# EAGLE design Siguino (EAGLE 9.2.2)
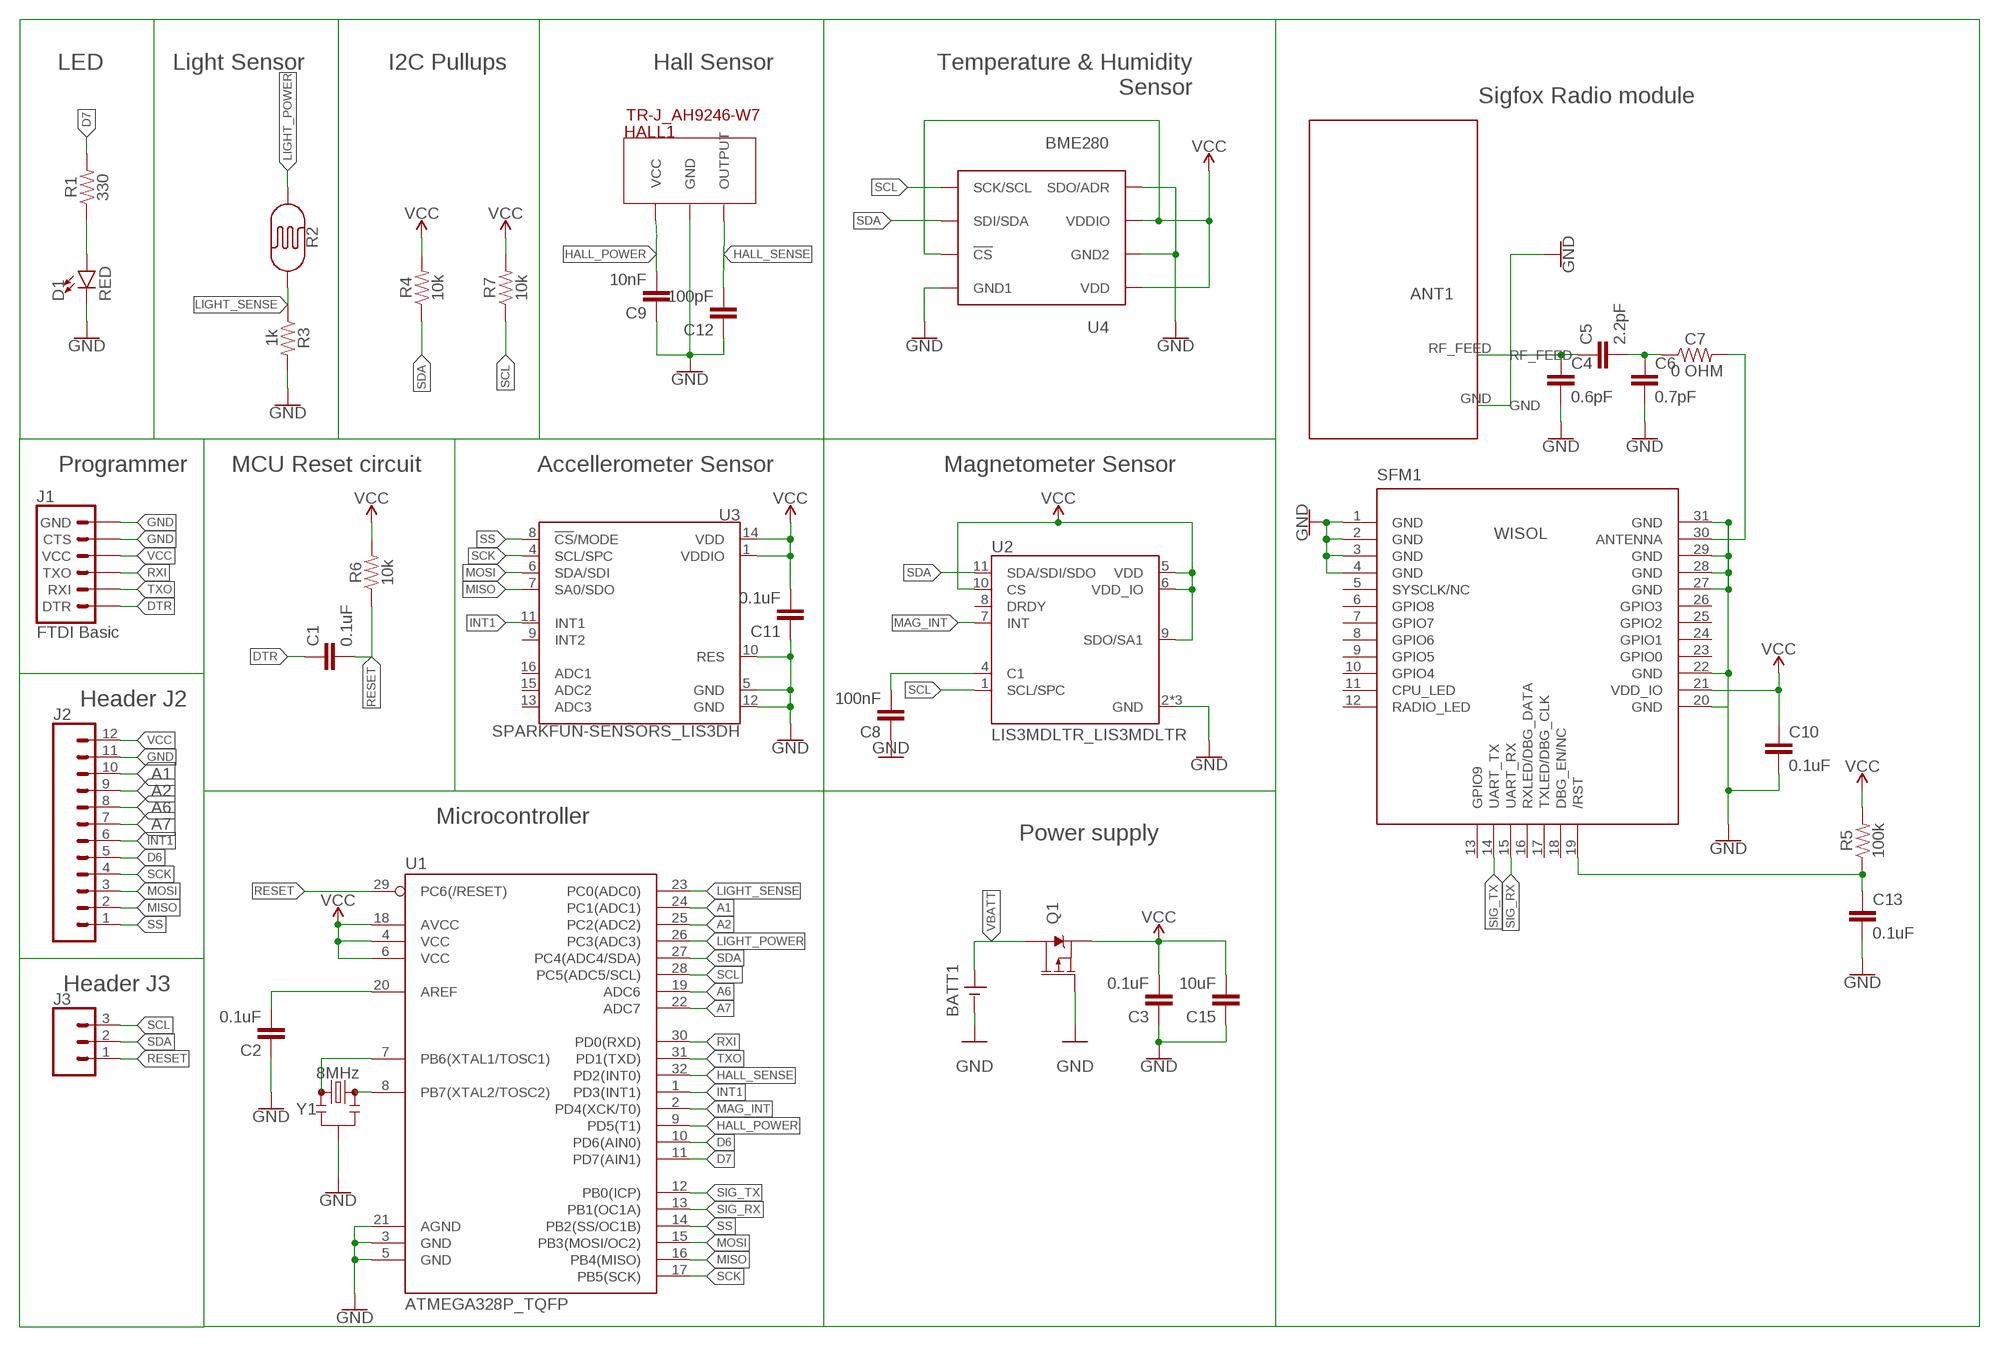
[diagram p0: schematic, sheet 1]

## Parts
ANT1  PROOB471  PRO-OB-512ONBOARD  [ONBOARD_SMD_2400]
BATT1  SPARKFUN-BATTERIES_CR2-BATTERY-HOLDERPTH  [SPARKFUN-BATTERIES_BATTERYHOLDER-CR2]
C1  0.1uF  0.1UF-0603-25V-5%  [0603]
C2  0.1uF  0.1UF-0603-25V-5%  [0603]
C3  0.1uF  0.1UF-0603-25V-5%  [0603]
C4  0.6pF  0.8PF-0402-50V-0.1PF  [0402]
C5  2.2pF  0.8PF-0402-50V-0.1PF  [0402]
C6  0.7pF  0.8PF-0402-50V-0.1PF  [0402]
C7  0 OHM  RESISTOR0402  [0402]
C8  100nF  0.1UF-0603-25V-5%  [0603]
C9  10nF  10NF-0603-50V-10%  [0603]
C10  0.1uF  0.1UF-0603-25V-(+80/-20%)  [0603]
C11  0.1uF  0.1UF-0603-25V-5%  [0603]
C12  100pF  100PF-0603-50V-5%  [0603]
C13  0.1uF  0.1UF-0603-25V-(+80/-20%)  [0603]
C15  10uF  10UF-0603-6.3V-20%  [0603]
D1  RED  LED-RED0603  [LED-0603]
HALL1  TR-J_AH9246-W7  [TR-J_SC-59]
J1  FTDI Basic  6_PIN_SERIAL_TARGET  [1X06]
J2  CONN_12  [1X12]
J3  CONN_03  [1X03]
Q1  MOSFET P-CH 20V 5.3A SOT-23  MOSFET_PCHSI2323DDS  [SOT23-3]
R1  330  330OHM-0603-1/10W-1%  [0603]
R2  PHOTOCELLPTH  [PHOTOCELL]
R3  1k  1KOHM-0603-1/10W-1%  [0603]
R4  10k  10KOHM-0603-1/10W-1%  [0603]
R5  100k  100KOHM-0603-1/10W-1%  [0603]
R6  10k  10KOHM-0603-1/10W-1%  [0603]
R7  10k  10KOHM-0603-1/10W-1%  [0603]
SFM1  WISOL_WSSFM10HANDSOLDER  [WISOL_WSSFM10]
U1  ATMEGA328P_TQFP  [TQFP32-08]
U2  LIS3MDLTR_LIS3MDLTR  [LIS3MDLTR_LGA12R50P4X4_200X200X100]
U3  SPARKFUN-SENSORS_LIS3DH  [SPARKFUN-SENSORS_LGA-16-3X3]
U4  BME280  BME280COMPONENTLIBRARY_BME280  [BME280COMPONENTLIBRARY_BME280_LGA]
Y1  8MHz  RESONATOR-8MHZSMD_3.2X1.3  [RESONATOR-SMD-3.2X1.3]

## Nets
A1: J2.10 U1.24(PC1(ADC1))
A2: J2.9 U1.25(PC2(ADC2))
A6: J2.8 U1.19(ADC6)
A7: J2.7 U1.22(ADC7)
D6: J2.5 U1.10(PD6(AIN0))
D7: R1.2 U1.11(PD7(AIN1))
DTR: C1.1 J1.1(DTR)
GND: ANT1.GND BATT1.GND C2.1 C3.1 C4.2 C6.2 C8.1 C9.1 C10.2 C11.1 C12.1 C13.2 C15.1 D1.C HALL1.3(GND) J1.5(CTS) J1.6(GND) J2.11 Q1.1(G) R3.2 SFM1.1(GND) SFM1.2(GND) SFM1.3(GND) SFM1.4(GND) SFM1.20(GND) SFM1.22(GND) SFM1.27(GND) SFM1.28(GND) SFM1.29(GND) SFM1.31(GND) U1.3(GND) U1.5(GND) U1.21(AGND) U2.2(GND) U2.3(GND) U2.12(GND) U3.5(GND) U3.10(RES) U3.12(GND) U4.P$1(GND1) U4.P$5(SDO/ADR) U4.P$7(GND2) Y1.2
HALL_POWER: C9.2 HALL1.1(VCC) U1.9(PD5(T1))
HALL_SENSE: C12.2 HALL1.2(OUTPUT) U1.32(PD2(INT0))
INT1: J2.6 U1.1(PD3(INT1)) U3.11(INT1)
LIGHT_POWER: R2.1 U1.26(PC3(ADC3))
LIGHT_SENSE: R2.2 R3.1 U1.23(PC0(ADC0))
MAG_INT: U1.2(PD4(XCK/T0)) U2.7(INT)
MISO: J2.2 U1.16(PB4(MISO)) U3.7(SA0/SDO)
MOSI: J2.3 U1.15(PB3(MOSI/OC2)) U3.6(SDA/SDI)
N$1: C2.2 U1.20(AREF)
N$2: U1.8(PB7(XTAL2/TOSC2)) Y1.3
N$3: U1.7(PB6(XTAL1/TOSC1)) Y1.1
N$4: ANT1.RF_FEED C4.1 C5.1
N$5: C13.1 R5.1 SFM1.19(/RST)
N$6: C7.2 SFM1.30(ANTENNA)
N$7: C5.2 C6.1 C7.1
N$9: C8.2 U2.4(C1)
N$19: D1.A R1.1
RESET: C1.2 J3.1 R6.1 U1.29(PC6(/RESET))
RXI: J1.3(TXO) U1.30(PD0(RXD))
SCK: J2.4 U1.17(PB5(SCK)) U3.4(SCL/SPC)
SCL: J3.3 R7.1 U1.28(PC5(ADC5/SCL)) U2.1(SCL/SPC) U4.P$4(SCK/SCL)
SDA: J3.2 R4.1 U1.27(PC4(ADC4/SDA)) U2.11(SDA/SDI/SDO) U4.P$3(SDI/SDA)
SIG_RX: SFM1.15(UART_RX) U1.13(PB1(OC1A))
SIG_TX: SFM1.14(UART_TX) U1.12(PB0(ICP))
SS: J2.1 U1.14(PB2(SS/OC1B)) U3.8(!CS!/MODE)
TXO: J1.2(RXI) U1.31(PD1(TXD))
VBATT: BATT1.VBATT Q1.3(D)
VCC: C3.2 C10.1 C11.2 C15.2 J1.4(VCC) J2.12 Q1.2(S) R4.2 R5.2 R6.2 R7.2 SFM1.21(VDD_IO) U1.4(VCC) U1.6(VCC) U1.18(AVCC) U2.5(VDD) U2.6(VDD_IO) U2.9(SDO/SA1) U2.10(CS) U3.1(VDDIO) U3.14(VDD) U4.P$2(!CS) U4.P$6(VDDIO) U4.P$8(VDD)
Unconnected: SFM1.5(SYSCLK/NC) SFM1.6(GPIO8) SFM1.7(GPIO7) SFM1.8(GPIO6) SFM1.9(GPIO5) SFM1.10(GPIO4) SFM1.11(CPU_LED) SFM1.12(RADIO_LED) SFM1.13(GPIO9) SFM1.16(RXLED/DBG_DATA) SFM1.17(TXLED/DBG_CLK) SFM1.18(DBG_EN/NC) SFM1.23(GPIO0) SFM1.24(GPIO1) SFM1.25(GPIO2) SFM1.26(GPIO3) U2.8(DRDY) U3.9(INT2) U3.13(ADC3) U3.15(ADC2) U3.16(ADC1)

## Notes on the sheet
- LED | Light Sensor | Hall Sensor
- Temperature & Humidity
  Sensor
- I2C Pullups
- Sigfox Radio module
- Programmer | MCU Reset circuit | Accellerometer Sensor | Magnetometer Sensor
- Header J2
- Microcontroller
- Power supply
- Header J3

## Library data of the parts
ANT1 = proant:PRO-OB-512: Proant OnBoard Antenna PRO-OB-512 for 848/2400MHz comms (e.g. SigFox)
BATT1 = Siguino:SPARKFUN-BATTERIES_CR2-BATTERY-HOLDER: CR2 Battery holder from MPD, see DigiKey product here: https://www.digikey.ie/product-detail/en/mpd-memory-protection-devices/BH-CR2-PC/BH-CR2-PC-ND/3029219
C1-C3 C11 = SparkFun-Capacitors:0.1UF: 0.1µF ceramic capacitors A capacitor is a passive two-terminal electrical component used to store electrical energy temporarily in an electric field.; PROD_ID: CAP-08604
C4-C6 = SparkFun-Capacitors:0.8PF: 0.8pF ceramic capacitors A capacitor is a passive two-terminal electrical component used to store electrical energy temporarily in an electric field.; PROD_ID: CAP-13456; VALUE: 0.8pF
C7 = SparkFun-Resistors:RESISTOR: Generic Resistor Package
C8 = SparkFun-Capacitors:0.1UF: 0.1µF ceramic capacitors A capacitor is a passive two-terminal electrical component used to store electrical energy temporarily in an electric field.; PROD_ID: CAP-08604; VALUE: 0.1uF
C9 = SparkFun-Capacitors:10NF: 0.01uF/10nF/10,000pF ceramic capacitors A capacitor is a passive two-terminal electrical component used to store electrical energy temporarily in an electric field. CAP-09321; PROD_ID: CAP-00867
C10 C13 = SparkFun-Capacitors:0.1UF: 0.1µF ceramic capacitors A capacitor is a passive two-terminal electrical component used to store electrical energy temporarily in an electric field.; PROD_ID: CAP-00810
C12 = SparkFun-Capacitors:100PF: 100pF/0.1nF ceramic capacitors A capacitor is a passive two-terminal electrical component used to store electrical energy temporarily in an electric field.; PROD_ID: CAP-07883
C15 = SparkFun-Capacitors:10UF: 10.0µF ceramic capacitors A capacitor is a passive two-terminal electrical component used to store electrical energy temporarily in an electric field.; PROD_ID: CAP-11015
D1 = SparkFun-LED:LED-RED: Red SMD LED Used in manufacturing of most products at SparkFun Packages: 0603 - SMD 0603 package [Product Link] <http://docs.avagotech.com/docs/AV02-0551EN> 0603 SMART - SMD 0603 SMART package ( more efficient and expensive)[Product Link] <http://www.osram-os.com/Graphics/XPic2/00077099_0.pdf> 1206 - SMD1206 package [Product Link] <https://www.sparkfun.com/datasheets/DevTools/LilyPad/Q150OVS4.pdff> SparkFun Products: Pro Mini 328 -5V <https://www.sparkfun.com/products/821> RedBoard <https://www.sparkfun.com/products/12757> IOIO-OTG <https://www.sparkfun.com/products/13613>; PROD_ID: DIO-00819
HALL1 = Siguino:TR-J_AH9246-W7: Hall effect switch, surface mount, part number AH9246-W-7
J1 = SparkFun-Connectors:6_PIN_SERIAL_TARGET: 6-pin header connection for use with the "FTDI BASIC" pinout - TARGET SIDE. Also known as "Arduino Serial Program Header". It is used to mate with our FTDI Basic serial programmers using the Arduino IDE. Note, this device has "TARGET" in the name. It is intended to be used on a design that contains a target micro-controller that you wish to program. The "sister" device, named "CABLE" is inteneded to be used on a design that usually lives on the end of your USB cable and prvides the converter chip (FTDI232 or FTDI231x) to commnicate serial RX/TX. You can populate with some of these: Break Away Headers - Straight <https://www.sparkfun.com/products/116> (PRT-00116) For reference (or to suit your programming needs) check out these designs: SparkFun FTDI Basic Breakout - 5V <https://www.sparkfun.com/products/9716> (DEV-09716) SparkFun FTDI Basic Breakout - 3.3V <https://www.sparkfun.com/products/9873> (DEV-09873) SparkFun FTDI SmartBasic <https://www.sparkfun.com/products/12935> (DEV-12935) SparkFun Beefy 3 - FTDI Basic Breakout <https://www.sparkfun.com/products/13746> (DEV-13746)
J2 = SparkFun-Connectors:CONN_12: Multi connection point. Often used as Generic Header-pin footprint for 0.1 inch spaced/style header connections On any of the 0.1 inch spaced packages, you can populate with these: Break Away Headers - Straight <https://www.sparkfun.com/products/116> (PRT-00116) Break Away Male Headers - Right Angle <https://www.sparkfun.com/products/553> (PRT-00553) Female Headers <https://www.sparkfun.com/products/115> (PRT-00115) Break Away Headers - Machine Pin <https://www.sparkfun.com/products/117> (PRT-00117) Break Away Female Headers - Swiss Machine Pin <https://www.sparkfun.com/products/743> (PRT-00743) For SCREWTERMINALS and SPRING TERMINALS visit here: Screw Terimnals on SparkFun.com <https://www.sparkfun.com/search/results?term=Screw+Terminals> (5mm/3.5mm/2.54mm spacing) This device is also useful as a general connection point to wire up your design to another part of your project. Our various solder wires solder well into these plated through hole pads. Hook-Up Wire - Assortment (Stranded, 22 AWG) <https://www.sparkfun.com/products/11375> (PRT-11375) Hook-Up Wire - Assortment (Solid Core, 22 AWG) <https://www.sparkfun.com/products/11367> (PRT-11367) View the entire wire category on our website here <https://www.sparkfun.com/categories/141> Special notes: Molex polarized connector foot print use with SKU : PRT-08231 with associated crimp pins and housings. 1MM SMD Version SKU: PRT-10208 NOTES ON THE VARIANTS LOCK and LOCK_LONGPADS... This footprint was designed to help hold the alignment of a through-hole component (i.e. 6-pin header) while soldering it into place. You may notice that each hole has been shifted either up or down by 0.005 of an inch from it's more standard position (which is a perfectly straight line). This slight alteration caused the pins (the squares in the middle) to touch the edges of the holes. Because they are alternating, it causes a "brace" to hold the component in place. 0.005 has proven to be the perfect amount of "off-center" position when using our standard breakaway headers. Although looks a little odd when you look at the bare footprint, once you have a header in there, the alteration is very hard to notice. Also,if you push a header all the way into place, it is covered up entirely on the bottom side.
J3 = SparkFun-Connectors:CONN_03: Multi connection point. Often used as Generic Header-pin footprint for 0.1 inch spaced/style header connections On any of the 0.1 inch spaced packages, you can populate with these: Break Away Headers - Straight <https://www.sparkfun.com/products/116> (PRT-00116) Break Away Male Headers - Right Angle <https://www.sparkfun.com/products/553> (PRT-00553) Female Headers <https://www.sparkfun.com/products/115> (PRT-00115) Break Away Headers - Machine Pin <https://www.sparkfun.com/products/117> (PRT-00117) Break Away Female Headers - Swiss Machine Pin <https://www.sparkfun.com/products/743> (PRT-00743) Stackable Header - 3 Pin (Female, 0.1") <https://www.sparkfun.com/products/13875> (PRT-13875) For SCREWTERMINALS and SPRING TERMINALS visit here: Screw Terimnals on SparkFun.com <https://www.sparkfun.com/search/results?term=Screw+Terminals> (5mm/3.5mm/2.54mm spacing) This device is also useful as a general connection point to wire up your design to another part of your project. Our various solder wires solder well into these plated through hole pads. Hook-Up Wire - Assortment (Stranded, 22 AWG) <https://www.sparkfun.com/products/11375> (PRT-11375) Hook-Up Wire - Assortment (Solid Core, 22 AWG) <https://www.sparkfun.com/products/11367> (PRT-11367) View the entire wire category on our website here <https://www.sparkfun.com/categories/141> Special notes: Molex polarized connector foot print use with SKU : PRT-08232 with associated crimp pins and housings.
Q1 = SparkFun-DiscreteSemi:MOSFET_PCH: P-channel MOSFETs Voltage controlled devices that allow control of high current outputs E.g. See Digikey Product here: SI2323DDS-T1-GE3 <https://www.digikey.ie/product-detail/en/vishay-siliconix/SI2323DDS-T1-GE3/SI2323DDS-T1-GE3CT-ND/4142086>; PROD_ID: SI2323DDS-T1-GE3
R1 = SparkFun-Resistors:330OHM: 330Ω resistor A resistor is a passive two-terminal electrical component that implements electrical resistance as a circuit element. Resistors act to reduce current flow, and, at the same time, act to lower voltage levels within circuits. - Wikipedia; PROD_ID: RES-00818
R2 = SparkFun-Sensors:PHOTOCELL: Photocell (Photodetector, Photo Resistor, CdS) This is a very small light sensor. A photocell changes (also called a photodetector, photo resistor, CdS or photoconductive cell) resistance depending on the amount of light it is exposed to. These little sensors make great ambient light triggers (when light in the room turns on, do something). Datasheet <http://cdn.sparkfun.com/datasheets/Sensors/LightImaging/SEN-09088.pdf> SparkFun Products Mini Photocell <https://www.sparkfun.com/products/9088> (SEN-09088); PROD_ID: COMP-09129; SF_ID: SEN-09088
R3 = SparkFun-Resistors:1KOHM: 1kΩ resistor A resistor is a passive two-terminal electrical component that implements electrical resistance as a circuit element. Resistors act to reduce current flow, and, at the same time, act to lower voltage levels within circuits. - Wikipedia; PROD_ID: RES-07856
R4 R6 R7 = SparkFun-Resistors:10KOHM: 10kΩ resistor A resistor is a passive two-terminal electrical component that implements electrical resistance as a circuit element. Resistors act to reduce current flow, and, at the same time, act to lower voltage levels within circuits. - Wikipedia; PROD_ID: RES-00824
R5 = SparkFun-Resistors:100KOHM: 100kΩ resistor A resistor is a passive two-terminal electrical component that implements electrical resistance as a circuit element. Resistors act to reduce current flow, and, at the same time, act to lower voltage levels within circuits. - Wikipedia; PROD_ID: RES-07828
SFM1 = Siguino:WISOL_WSSFM10: WiSOL WSSFM10 Sigfox Module with PCB Footprint to enable handsolder
U1 = SparkFun-IC-Microcontroller:ATMEGA328P_TQFP: Popular 328P in QFP Storefront component: ATmega328 - TQFP <https://www.sparkfun.com/products/13448> (COM-13448) Datasheet <http://www.sparkfun.com/datasheets/Components/SMD/ATMega328.pdf> SparkFun Products SparkFun RedBoard - Programmed with Arduino <https://www.sparkfun.com/products/12757> (DEV-12757) Arduino Pro Mini 328 - 5V/16MHz <https://www.sparkfun.com/products/11113> (DEV-11113) Arduino Pro Mini 328 - 3.3V/8MHz <https://www.sparkfun.com/products/11114> (DEV-11114) SparkFun OpenLog <https://www.sparkfun.com/products/13712> (DEV-13712) SparkFun MicroView - OLED Arduino Module <https://www.sparkfun.com/products/12923> (DEV-12923) SparkFun Digital Sandbox <https://www.sparkfun.com/products/12651> (DEV-12651) SparkFun PicoBoard <https://www.sparkfun.com/products/11888> (WIG-11888) Arduino Fio <https://www.sparkfun.com/products/10116> (DEV-10116) LilyPad Arduino 328 Main Board <https://www.sparkfun.com/products/13342> (DEV-13342) SparkFun RedStick <https://www.sparkfun.com/products/13741> (DEV-13741) LilyPad MP3 <https://www.sparkfun.com/products/11013> (DEV-11013) LilyPad Arduino SimpleSnap <https://www.sparkfun.com/products/10941> (DEV-10941) SparkFun Stepoko <https://www.sparkfun.com/products/13899> (ROB-13899) SparkFun Geiger Counter <https://www.sparkfun.com/products/11345> (SEN-11345) SparkFun EL Sequencer <https://www.sparkfun.com/products/12781> (COM-12781) Arduino Pro 328 - 5V/16MHz <https://www.sparkfun.com/products/10915> (DEV-10915) CryptoCape <https://www.sparkfun.com/products/12773> (DEV-12773) SparkFun IR Thermometer Evaluation Board - MLX90614 <https://www.sparkfun.com/products/10740> (SEN-10740) SparkFun RedBot Mainboard <https://www.sparkfun.com/products/12097> (ROB-12097) Arduino Pro 328 - 3.3V/8MHz <https://www.sparkfun.com/products/10914> (DEV-10914) SparkFun Block for Intel® Edison - Arduino <https://www.sparkfun.com/products/13036> (DEV-13036) SparkFun Simon Says - Surface Mount Soldering Kit <https://www.sparkfun.com/products/10935> (KIT-10935) SparkFun 7-Segment Serial Display - Red <https://www.sparkfun.com/products/11441> (COM-11441) SparkFun 7-Segment Serial Display - White <https://www.sparkfun.com/products/11629> (COM-11629) SparkFun 7-Segment Serial Display - Yellow <https://www.sparkfun.com/products/11443> (COM-11443) SparkFun 7-Segment Serial Display - Kelly Green <https://www.sparkfun.com/products/11440> (COM-11440) SparkFun 7-Segment Serial Display - Blue <https://www.sparkfun.com/products/11442> (COM-11442) SparkFun OpenSegment Serial Display - 20mm (Blue) <https://www.sparkfun.com/products/11647> (COM-11647) SparkFun OpenSegment Serial Display - 20mm (Green) <https://www.sparkfun.com/products/11646> (COM-11646) SparkFun OpenSegment Serial Display - 20mm (White) <https://www.sparkfun.com/products/11648> (COM-11648) SparkFun OpenSegment Serial Display - 20mm (Red) <https://www.sparkfun.com/products/11644> (COM-11644) SparkFun OpenSegment Serial Display - 20mm (Yellow) <https://www.sparkfun.com/products/11645> (COM-11645) SparkFun OpenSegment Shield <https://www.sparkfun.com/products/13190> (DEV-13190); PROD_ID: IC-09069
U2 = Siguino:LIS3MDLTR_LIS3MDLTR: LIS3MDL Series 3 Axis ±2/±8/±12/±16 g 3.6V High Performance Magnetometer LGA-12; DESCRIPTION: SENSOR MAGMTR I2C/SPI 12LGA; DIGI-KEY_PART_NUMBER: 497-13892-1-ND; DIGI-KEY_PURCHASE_URL: https://www.digikey.co.uk/product-detail/en/stmicroelectronics/LIS3MDLTR/497-13892-1-ND/4309737?WT.z_cid=ref_snapeda&utm_source=snapeda&utm_medium=aggregator&utm_campaign=buynow; MF: STMicroelectronics; MP: LIS3MDLTR; PACKAGE: VFLGA-12 STMicroelectronics
U3 = Siguino:SPARKFUN-SENSORS_LIS3DH: ST Microelectronics LIS3DH 3-Axis ±2/4/8/16g SPI/I2C Accelerometer The LIS3DH is a three axis MEMS linear accelerometer in the "nano" family. It has a digital I2C/SPI serial interface which makes it ideal for using in embedded applications. The device also features ultra low-power operational modes that allow advanced power saving and smart sleep to wake-up functions, built in detections with interrupts, and auxiliary ADC inputs Datasheet-XXXX <http://www.sparkfun.com/datasheets/Sensors/Accelerometer/LIS3DH.pdf> SparkFun Products SparkFun Triple Axis Accelerometer Breakout - LIS3DH <https://www.sparkfun.com/products/10345> (SEN-XXXXX) Triple Axis Accelerometer - LIS3DH <https://www.sparkfun.com/products/9755> (SEN-XXXXX); PROD_ID: IC-13419; SF_ID: N/A
U4 = Siguino:BME280COMPONENTLIBRARY_BME280; PROD_ID: IC-13090
Y1 = SparkFun-Clocks:RESONATOR-8MHZ: 8MHz Resonator Digikey Example <http://www.digikey.com/product-detail/en/murata-electronics-north-america/CSTCE10M0G55-R0/490-1196-1-ND/584633> Frequency: 8MHz Frequency Stability: ±0.2% Frequency Tolerance: ±0.5% Capacitance: 33pF SparkFun Products Arduino Pro Mini 328- 3.3V/8MHz <https://www.sparkfun.com/products/11114> SparkFun Digital Sandbox <https://www.sparkfun.com/products/12651>; PROD_ID: XTAL-08895

## Board
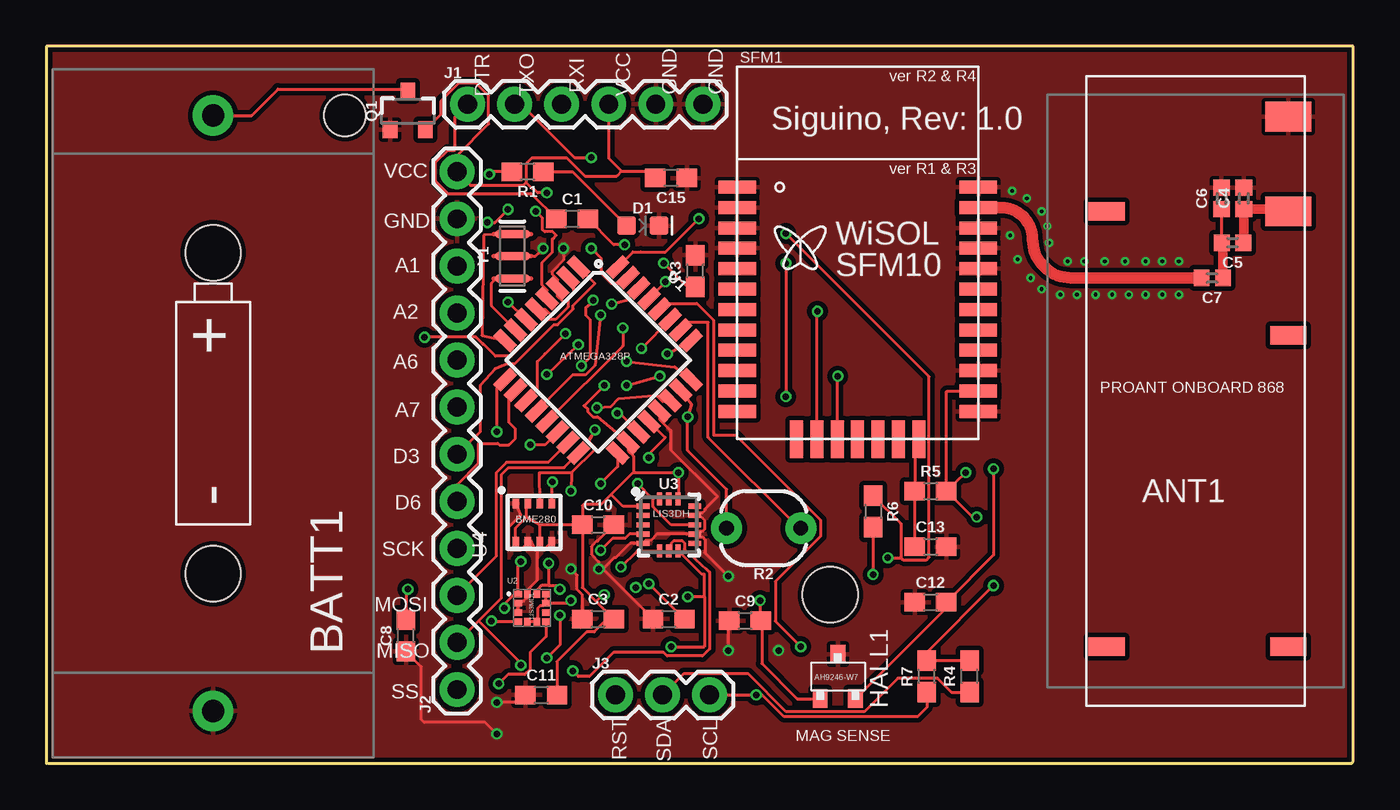
[diagram p1: board, top side]
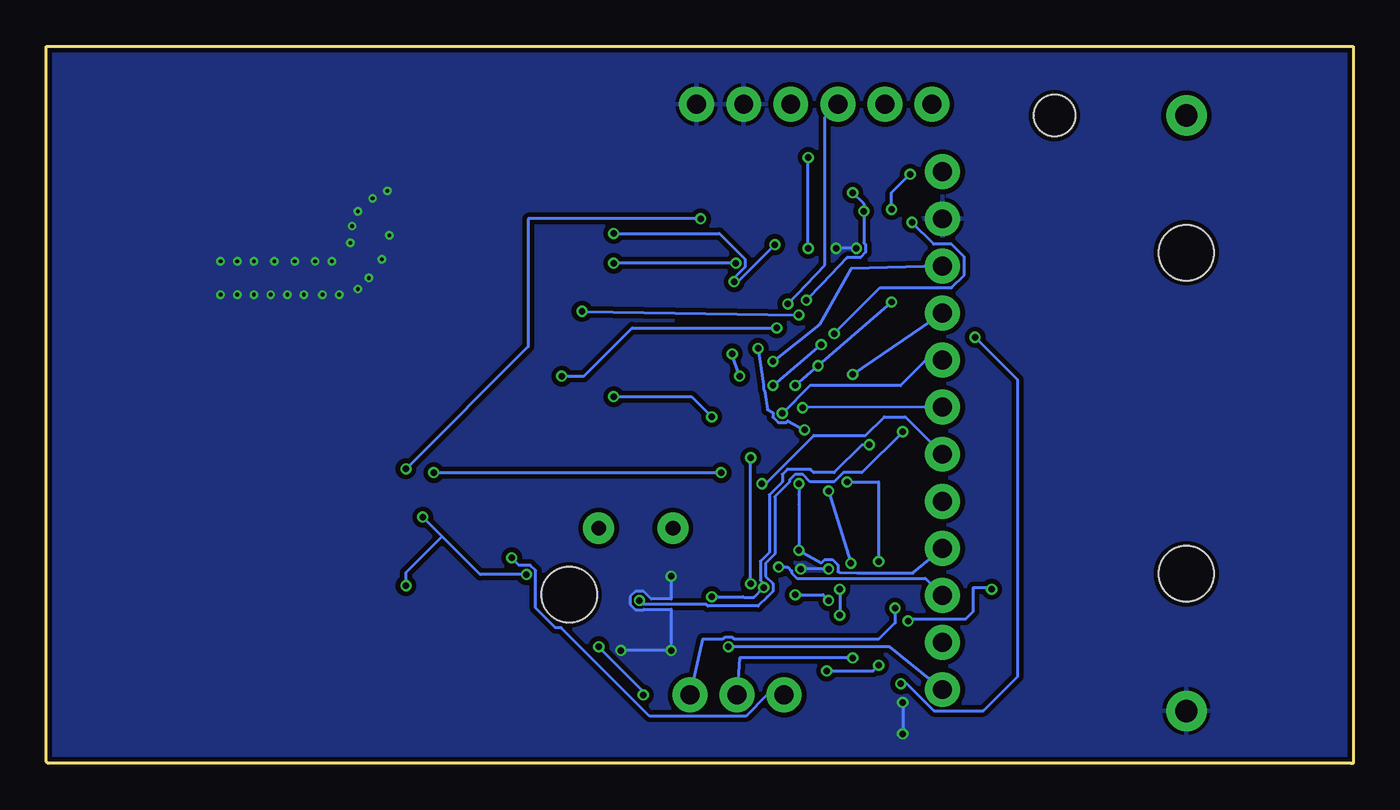
[diagram p2: board, bottom side, seen from below]

Size 70.5 x 38.7 mm. Coordinates in mm from the lower left corner, seen from the top.
Outline: 0.1,0 70.4,0 70.5,0.1 70.5,38.7 0,38.7 0,0
Copper layers (1*16): Top 0.018mm / dielectric 1.55mm / Bottom 0.018mm
Design rules "Multi-CB_2L_125um-Tracks_OL35um *": minimum track width 0.125mm, minimum drill 0.2mm, track to track 0.125mm, track to pad 0.125mm, pad to pad 0.125mm, via to via 0.125mm, smd to smd 0mil, copper to edge 0.2mm, drill to drill 0.2mm, minimum pad ring 0.125mm, minimum via ring 0.125mm, stop-mask expansion 2mil, vias tented up to drill 0.45mm, thermal gap 0.2mm
Holes 3 mm at 42.3,9.1

### Footprints (pad centres in the part's own frame; a part is rotated, then mirrored left to right if it is on the bottom)
ONBOARD_SMD_2400 = smd 2.5 x 1.6: GND 5,14.8; RF_FEED 5,9.7 | smd 1.95 x 1: NC$1 -4.8,9.7; NC$2 5,3; NC$3 5,-13.8; NC$4 -4.8,-13.8
SPARKFUN-BATTERIES_BATTERYHOLDER-CR2 = drill 1.2 pad 2.184: GND -16.065,0; VBATT 16.065,0 | hole 3: -8.66,0; 8.66,0 | hole 2.25: 16.065,-7.11
0603 = smd 1.1 x 1: 1 -0.85,0; 2 0.85,0
0402 = smd 0.85 x 0.9: 1 -0.58,0; 2 0.58,0
LED-0603 = smd 1 x 1: A -0.877,0; C 0.877,0
TR-J_SC-59 = smd 0.8 x 1: 1 -0.95,-1.2; 2 0.95,-1.2; 3 0,1.2
1X06 = drill 1.016 pad 1.88: 1 0,0; 2 2.54,0; 3 5.08,0; 4 7.62,0; 5 10.16,0; 6 12.7,0
1X12 = drill 1.016 pad 1.88: 1 0,0; 2 2.54,0; 3 5.08,0; 4 7.62,0; 5 10.16,0; 6 12.7,0; 7 15.24,0; 8 17.78,0; 9 20.32,0; 10 22.86,0; 11 25.4,0; 12 27.94,0
1X03 = drill 1.016 pad 1.88: 1 0,0; 2 2.54,0; 3 5.08,0
SOT23-3 = smd 0.8 x 0.9: 1 -0.95,-1; 2 0.95,-1; 3 0,1.1
PHOTOCELL = drill 0.8 pad 1.676: 1 -2,0; 2 2,0
WISOL_WSSFM10 = smd 2 x 0.7: 1 -6.5,6; 2 -6.5,4.9; 3 -6.5,3.8; 4 -6.5,2.7; 5 -6.5,1.6; 6 -6.5,0.5; 7 -6.5,-0.6; 8 -6.5,-1.7; 9 -6.5,-2.8; 10 -6.5,-3.9; 11 -6.5,-5; 12 -6.5,-6.1; 20 6.5,-6.1; 21 6.5,-5; 22 6.5,-3.9; 23 6.5,-2.8; 24 6.5,-1.7; 25 6.5,-0.6; 26 6.5,0.5; 27 6.5,1.6; 28 6.5,2.7; 29 6.5,3.8; 30 6.5,4.9; 31 6.5,6 | smd 0.7 x 2: 13 -3.3,-7.6; 14 -2.2,-7.6; 15 -1.1,-7.6; 16 0,-7.6; 17 1.1,-7.6; 18 2.2,-7.6; 19 3.3,-7.6
TQFP32-08 = smd 1.27 x 0.559: 1 -4.293,2.8; 2 -4.293,2; 3 -4.293,1.2; 4 -4.293,0.4; 5 -4.293,-0.4; 6 -4.293,-1.2; 7 -4.293,-2; 8 -4.293,-2.8; 17 4.293,-2.8; 18 4.293,-2; 19 4.293,-1.2; 20 4.293,-0.4; 21 4.293,0.4; 22 4.293,1.2; 23 4.293,2; 24 4.293,2.8 | smd 0.559 x 1.27: 9 -2.8,-4.293; 10 -2,-4.293; 11 -1.2,-4.293; 12 -0.4,-4.293; 13 0.4,-4.293; 14 1.2,-4.293; 15 2,-4.293; 16 2.8,-4.293; 25 2.8,4.293; 26 2,4.293; 27 1.2,4.293; 28 0.4,4.293; 29 -0.4,4.293; 30 -1.2,4.293; 31 -2,4.293; 32 -2.8,4.293
LIS3MDLTR_LGA12R50P4X4_200X200X100 = smd 0.45 x 0.35: 1 -0.76,0.75; 2 -0.76,0.25; 3 -0.76,-0.25; 4 -0.76,-0.75; 7 0.76,-0.75; 8 0.76,-0.25; 9 0.76,0.25; 10 0.76,0.75 | smd 0.35 x 0.45: 5 -0.25,-0.76; 6 0.25,-0.76; 11 0.25,0.76; 12 -0.25,0.76
SPARKFUN-SENSORS_LGA-16-3X3 = smd 0.7 x 0.28: 1 -1.4,1; 2 -1.4,0.5; 3 -1.4,0; 4 -1.4,-0.5; 5 -1.4,-1; 9 1.4,-1; 10 1.4,-0.5; 11 1.4,0; 12 1.4,0.5; 13 1.4,1 | smd 0.28 x 0.7: 6 -0.5,-1.4; 7 0,-1.4; 8 0.5,-1.4; 14 0.5,1.4; 15 0,1.4; 16 -0.5,1.4
BME280COMPONENTLIBRARY_BME280_LGA = smd 0.5 x 0.35: P$1 1.025,0.975; P$2 1.025,0.325; P$3 1.025,-0.325; P$4 1.025,-0.975; P$5 -1.025,-0.975; P$6 -1.025,-0.325; P$7 -1.025,0.325; P$8 -1.025,0.975
RESONATOR-SMD-3.2X1.3 = smd 0.45 x 1.905: 1 -1.2,0; 2 0,0; 3 1.2,0

### Placement (x,y rotation side)
ANT1  62,20.1 0 top
BATT1  9,18.9 90 top
C1  28.37,29.39 0 top
C2  33.58,7.8 0 top
C3  29.77,7.8 0 top
C4  64.6,30.5 90 top
C5  64,28.1 180 top
C6  63.4,30.5 90 top
C7  62.9,26.2 180 top
C8  19.4,6.9 90 top
C9  37.7,7.7 0 top
C10  29.77,12.88 0 top
C11  26.7,3.7 0 top
C12  47.7,8.7 0 top
C13  47.7,11.7 0 top
C15  33.7,31.6 180 top
D1  32.17,29.03 0 top
HALL1  42.7,4.7 0 top
J1  22.72,35.57 0 top
J2  22.15,3.99 90 top
J3  30.7,3.7 0 top
Q1  19.5,35.2 0 top
R1  25.96,31.93 180 top
R2  38.7,12.7 180 top
R3  35.01,26.58 90 top
R4  49.8,4.7 90 top
R5  47.7,14.7 0 top
R6  44.6,13.6 270 top
R7  47.5,4.7 90 top
SFM1  43.77,25.1 0 top
U1  29.77,21.77 315 top
U2  26.2,8.4 0 top
U3  33.58,12.88 0 top
U4  26.3,13 90 top
Y1  25.14,27.38 90 top

### Tracks (layer width: path | path; a pad name or v marks a point on that pad's centre or on a via)
A1  (via drill 0.35)
  Top 0.152: v31.3,21.7 33.9,21.4 U1.24
  Bottom 0.152: J2.10 27.1,26.7 28.8,23.7 v31.3,21.7
A2  (via drill 0.35)
  Top 0.152: v27,21 v28.7,22.6 | v31.3,20.4 v33.1,20.9 | v33.5,22.1 U1.25
  Bottom 0.152: J2.9 v27,21 | v28.7,22.6 v31.3,20.4 | v33.1,20.9 v33.5,22.1
A6  (via drill 0.35)
  Top 0.152: v30.8,18.9 30.94,18.9 U1.19
  Bottom 0.152: v30.8,18.9 29.3,20.4 24.41,20.4 23.04,21.77 J2.8
A7  (via drill 0.35)
  Top 0.152: v29.7,19.2 30.46,19.27 30.87,19.68 32.75,19.87 32.92,19.87 33.24,19.54 U1.22
  Bottom 0.152: J2.7 v29.7,19.2
D6
  Top 0.152: J2.5 22.15,15.04 23.32,16.21 23.32,17.28 24.37,17.28 24.45,17.19 24.95,17.19 25.31,17.55 25.31,18.05 24.95,18.41 24.95,19.78 U1.10
D7  (via drill 0.35)
  Top 0.15: U1.11 26.5,20.2 26.5,21.7 26.9,22.1 | R1.2 24.03,31.93 v23.9,31.8
  Top 0.152: 26.9,22.1 v28,23.2 | v23.8,29.2 24.2,29.2 v24.9,29.9
  Bottom 0.152: v28,23.2 25.52,25.68 21.67,25.68 20.98,26.37 20.98,27.33 21.67,28.02 22.62,28.02 v23.8,29.2 | v24.9,29.9 24.9,30.8 v23.9,31.8
DTR
  Top 0.152: C1.1 26.15,30.76 21.67,30.76 20.98,31.45 20.98,32.41 21.67,33.1 22.05,33.1 22.05,34.9 J1.1
GND  (via drill 0.2, 0.35)
  Top 0.15: 26.07,9.47 25.95,9.34 U2.12 25.95,8.97 25.87,8.89
  Top 0.152: Y1.2 26.38,27.38 v26.8,27.8 | v27.9,27.8 27.9,27.15 27.3,26.55 27.3,26.39 27.58,26.11 U1.3 27.58,25.2 27.87,24.92 27.87,24.75 27.35,24.24 27.19,24.24 26.9,24.52 U1.5 | C3.1 28.92,9.11 28.64,9.38 28.64,10.16 v28.3,10.5 | 30.03,10.5 v29.8,10.5 29.8,10.89 29.4,11.29 29.4,11.71 29.69,12 29.74,12 C10.2 | 30.03,10.5 C2.1 | 30.03,10.5 30.63,11.1 30.71,11.1 31.49,11.88 U3.5 32.34,12.04 32.61,12.04 32.95,12.38 U3.10 | U3.10 35.14,12.22 35.41,12.22 35.53,12.1 35.53,11.37 v36.8,10.1 | v36.8,6.1 36.8,7.65 C9.1 | U1.21 33.09,18.57 33.68,17.98 33.68,16.92 36.2,14.4 35.53,13.73 35.53,13.66 35.41,13.54 35.14,13.54 | 35.14,13.54 U3.12 | U3.10 35.14,12.54 35.41,12.54 35.53,12.66 35.53,13.1 35.14,13.5 35.14,13.54 | 26.5,11.52 26.37,11.52 26.25,11.64 26.25,11.7 | 26.5,11.52 26.88,11.52 27,11.64 27,11.7 U4.P$5 | 26.25,11.7 U4.P$7 | U4.P$1 25.58,13.38 24.95,12.74 24.95,11.64 25.07,11.52 25.58,11.52 26.11,12.05 26.25,11.7 | U2.3 U2.2 25.56,8.77 25.75,8.77 25.87,8.89 | 26.5,11.52 26.5,9.89 26.07,9.47 | C11.1 25.45,3.3 v24.3,3.3 | v24.3,1.6 23.68,2.22 20.39,2.22 20.22,2.39 20.22,5.23 C8.1
  Bottom 0.152: v26.8,27.8 v27.9,27.8 | v28.3,10.5 v29.8,10.5 | v39.5,6.1 v36.8,6.1 36.8,8.32 38.27,8.32 38.29,8.3 38.71,8.3 39,8.59 39,9.01 38.71,9.3 38.29,9.3 37.87,8.88 36.8,8.88 v36.8,10.1 | v24.3,3.3 v24.3,1.6
  other vias: 61.1,25.3 60.2,25.3 59.3,25.3 58.4,25.3 57.5,25.3 56.6,25.3 55.6,25.3 54.7,25.3 53.7,25.6 53.1,26.2 52.4,27.2 61.1,27.1 60.2,27.1 59.3,27.1 58.2,27.1 57.1,27.1 56,27.1 55.1,27.1 54.1,28.1 54,29 53.7,29.8 52.9,30.5 52.1,30.9 52,28.5
  pour Bottom (isolate 0.254): 0,38.7 70.5,38.7 70.5,0 0,0
  pour Top (isolate 0.254): 0,38.7 70.5,38.7 70.5,0 0,0
HALL_POWER  (via drill 0.35)
  Top 0.15: HALL1.1 40.5,3.5 38.6,5.4 38.6,7.65 C9.2 38.5,7.75 v38.5,8.8 | U1.9 24.3,20.26 v24.3,17.9
  Bottom 0.15: v24.3,17.9 26.51,15.69 27.51,15.69 28,15.2 29.29,15.2 29.69,15.6 30.11,15.6 30.4,15.31 30.4,15.2 31.2,14.4 31.2,11.3 31.7,10.8 31.7,10.11 31.3,9.71 31.3,9.29 31.59,9 31.6,9 32.1,8.5 34.81,8.5 34.91,8.6 38.4,8.6 38.5,8.7 v38.5,8.8
HALL_SENSE  (via drill 0.35)
  Top 0.15: U1.32 31.65,27.61 32.06,27.61
  Top 0.152: HALL1.2 48.55,8.4 C12.2 51.1,11.25 v51.1,15.9 | v35.2,29.4 33.41,27.61 32.06,27.61
  Bottom 0.152: v35.2,29.4 44.5,29.4 44.5,22.5 v51.1,15.9
INT1  (via drill 0.35)
  Top 0.152: J2.6 23.4,17.9 23.4,20.4 24.2,21.3 24.91,21.59 25.29,21.59 27.39,23.69 27.58,23.69 28.42,24.52 28.42,24.72 29.6,25.9 U1.1 | v31.9,15.1 32.74,14.26 32.74,13.85 33.7,12.88 U3.11 | U1.1
  Bottom 0.152: v31.9,15.1 31.59,15.2 29.09,17.7 26.3,17.7 25.3,18.7 24.16,18.7 J2.6
LIGHT_POWER
  Top 0.15: R2.1 40.6,12.7
  Top 0.152: 40.6,12.7 35.7,17.6 35.7,23.8 34.63,23.8 U1.26
LIGHT_SENSE  (via drill 0.35)
  Top 0.15: U1.23 34.8,19.4 v34.6,18.7
  Top 0.152: R2.2 36.7,14.8 34.6,16.9 v34.6,18.7 | R3.1 34.57,25.73 v33.3,27 | v39.9,27 v39.9,19.8
  Bottom 0.152: v33.3,27 v39.9,27 | v39.9,19.8 35.7,19.8 v34.6,18.7
MAG_INT  (via drill 0.35)
  Top 0.15: U1.2 28.43,25.94 28.43,25.32
  Top 0.152: U2.7 26.96,6.86 26.1,6 26.1,5.09 25.81,4.8 24.9,4.8 v24.4,4.3 | v20.4,23 23.18,23 23.55,22.63 23.58,22.63 24.23,21.98 25.09,21.98 27.08,23.96 27.47,23.96 28.14,24.64 28.14,25.03 28.43,25.32
  Bottom 0.152: v24.4,4.3 24.07,4.3 22.62,2.85 19.95,2.85 18.1,4.7 18.1,20.7 v20.4,23
MISO  (via drill 0.35)
  Top 0.15: 27.93,15.97 U1.16
  Top 0.152: 23.31,7.69 24.54,8.92 24.54,15.58 24.94,15.97 27.93,15.97 | 23.31,7.69 J2.2 | v25.6,5.3 25.6,5.4 23.31,7.69 | U3.7 33.74,11.48 33.74,11.91 33.86,12.03 34.3,12.03 34.42,11.91 34.42,11.55 35.62,10.48 35.69,10.4 35.77,10.33 35.77,10.32 35.78,10.31 35.78,10.21 35.78,10.1 35.78,10.09 35.78,6.18 35.39,5.8 33.49,5.8 33.29,6 30.6,6 29.3,4.7 28.7,4.7 v28.4,5
  Bottom 0.152: v28.4,5 25.9,5 v25.6,5.3
MOSI  (via drill 0.35)
  Top 0.15: 31.88,11.48 U3.6
  Top 0.152: J2.3 24.27,11.19 24.27,15.69 24.82,16.25 27.08,16.25 U1.15 | v31,10.6 31.88,11.48
  Bottom 0.152: v31,10.6 30.5,10.6 30.3,10.4 30.3,10.29 30.01,10 23.08,10 J2.3
N$1  (via drill 0.35)
  Top 0.152: C2.2 34.4,7.8 v32.5,9.7 | v32.5,16.5 32.5,16.7 33.4,17.6 33.37,17.6 U1.20
  Bottom 0.152: v32.5,9.7 v32.5,16.5
N$2
  Top 0.152: Y1.3 23.6,28.5 23.5,23.1 U1.8
N$3
  Top 0.152: Y1.1 24.28,26.18 24,25.9 24,24.71 U1.7
N$4
  Top 0.152: 66.32,29.92 66.72,29.52 ANT1.RF_FEED
  Top 0.508: C5.1 64.6,28.12 C4.1 66.32,29.92
N$5
  Top 0.152: SFM1.19 46.85,17.28 R5.1 C13.1
N$6
  Top 0.61: C7.2 55.3,26.2 arc-90 53.2,28.3 arc90 51.5,30 SFM1.30
N$7
  Top 0.152: C6.1 63.4,28.12 C5.2
  Top 0.508: C5.2 63.48,28.04 C7.1
N$9  (via drill 0.35)
  Top 0.152: U2.4 24.06,7.65 v24.02,7.69 | v19.5,9.4 19.4,9.3 C8.2
  Bottom 0.152: v24.02,7.69 23.91,7.8 20.9,7.8 20.5,8.2 20.5,9.5 19.6,9.5 v19.5,9.4
N$19
  Top 0.152: R1.1 28.39,31.93 D1.A
RESET  (via drill 0.35)
  Top 0.15: U1.29 33.4,25.97 v33.4,26
  Top 0.152: v31.2,28 30.61,28 C1.2 | 46.1,11.12 46.22,11 47.48,11 47.62,11.14 47.62,20.88 v39.9,28.6 | R6.1 46.1,12.95 46.1,11.12 | v45.4,11.1 46.08,11.1 46.1,11.12
  Bottom 0.152: v31.2,28 33.2,26 v33.4,26 33.4,26.19 32.8,26.79 32.8,27.21 34.19,28.6 v39.9,28.6 | J3.1 31.63,3.7 32.77,2.56 37.96,2.56 42.72,7.32 43.04,7.32 44.1,8.39 44.1,10.41 44.39,10.7 45,10.7 v45.4,11.1
RXI  (via drill 0.35)
  Top 0.152: v30.5,24.8 31.3,25 U1.30
  Bottom 0.152: v30.5,24.8 28.5,26.9 28.5,34.87 J1.3
SCK  (via drill 0.35)
  Top 0.15: U3.4 31.46,12.38
  Top 0.152: v29.9,11.5 30.55,12.15 31.23,12.15 31.46,12.38 | U1.17 30.83,16.03 v29.9,15.1
  Bottom 0.152: J2.4 22.26,11.5 23.75,10.28 26.75,10.28 27.7,10.3 27.8,10.35 27.8,10.71 28.09,11 28.51,11 28.68,10.83 v29.9,11.5 29.9,14 29.9,14.5 v29.9,15.1
SCL  (via drill 0.35)
  Top 0.15: 25.44,10.74 U2.1 25.26,9.15 25.13,9.03 | R7.1 47.5,3.02 47,2.52 | U1.28 33.4,24.83 35.1,24.83
  Top 0.152: J3.3 v38.3,3.7 38.62,3.7 39.8,2.52 47,2.52 | v40.7,6.3 39.33,7.67 39.33,9.82 41.77,12.26 41.77,13.14 37.18,17.73 36.01,17.73 36.01,23.93 35.1,24.83 | 25.13,9.03 24.71,8.61 v24.71,8.39 | U4.P$4 27.28,15.17 v27.3,15.19 | 25.44,10.74 v25.6,10.9
  Bottom 0.152: v38.3,3.7 38.3,3.9 v40.7,6.3 | J3.3 35.1,6.7 34.01,6.7 33.91,6.8 33.49,6.8 33.39,6.7 25.6,6.7 24.71,7.59 v24.71,8.39 | v25.6,10.9 25.6,15.2 25.61,15.19 v27.3,15.19
SDA  (via drill 0.35)
  Top 0.15: U1.27 v32.1,22.4 | 48.84,3.85 R4.1 | U2.11 26.54,9.24 26.54,9.41 26.73,9.6
  Top 0.152: 48.84,3.85 48.08,4.6 45.94,4.6 44.13,2.8 39.91,2.8 37.87,4.84 34.38,4.84 J3.2 | v29.6,18 29.25,17.4 29.56,17.09 29.56,16.92 28.33,15.69 | U4.P$3 26.6,15.69 28.33,15.69 | 28.33,15.69 v28.3,14.7 | 27.1,9.6 26.73,9.6 | 27.1,9.6 27.7,9.6 v27.7,9.4 | v27.7,8 27.7,6.4 v27,5.7 | v27.1,10.8 27.1,9.6
  Bottom 0.152: v32.1,22.4 31.8,20.43 31.8,20.19 31.76,20.15 31.6,19.1 31.3,18.93 31.3,18.69 31.01,18.4 30.59,18.4 30.5,18.49 v29.6,18 | v28.3,14.7 v27.1,10.8 | v27,5.7 33.1,5.7 J3.2 | v27.7,9.4 v27.7,8
SIG_RX  (via drill 0.35)
  Top 0.152: v31.1,23.5 31.1,22.53 U1.13 | SFM1.15 42.67,20.87 v42.7,20.9
  Bottom 0.152: v31.1,23.5 31.2,23.6 31.3,23.5 38.9,23.5 41.5,20.9 v42.7,20.9
SIG_TX  (via drill 0.35)
  Top 0.152: SFM1.14 41.57,24.37 v41.6,24.4 | U1.12 28.4,20.96 29.08,20.96 29.6,21.49 v29.9,24.2
  Bottom 0.152: v41.6,24.4 v29.9,24.2
SS  (via drill 0.35)
  Top 0.15: U1.14 26.9,17.2 v26.1,17.2 | 35.5,10.2 35.48,10.22 35.36,10.22 34.1,11.48 U3.8
  Top 0.152: v33.7,6.3 35.5,6.3 35.5,9 | 35.5,9 35.5,10.2 | 35.5,9 v34.6,9
  Bottom 0.152: J2.1 25,6.3 v33.7,6.3 | v26.1,17.2 26.5,17.2 28,15.7 29.09,15.7 29.27,15.88 30.52,15.88 30.8,15.6 30.8,15.2 31.5,14.5 31.5,11.39 31.98,10.91 31.98,9.89 31.8,9.71 v31.8,9.5 32.34,8.96 32.87,8.96 32.9,9 v34.6,9
TXO  (via drill 0.35)
  Top 0.15: U1.31 31.08,25.91 30.48,25.91
  Top 0.152: 30.48,25.91 29.95,26.44 29.95,27.25 v29.4,27.8 | v29.4,32.7 28.49,32.7 25.62,35.57 J1.2
  Bottom 0.152: v29.4,27.8 v29.4,32.7
VBATT
  Top 0.152: BATT1.VBATT 11.06,34.97 12.5,36.4 19.4,36.4 Q1.3
VCC  (via drill 0.35)
  Top 0.152: C10.1 28.92,9.5 29.66,8.76 | 29.66,8.76 C3.2 30.26,7.8 29.55,7.1 29.15,7.1 27.55,5.5 C11.2 | R5.2 48.55,20.05 48.6,20.1 SFM1.21 | 25.89,31.34 25.76,31.2 22.88,31.2 J2.12 22.15,32.81 23.86,34.52 23.86,36.04 23.19,36.71 22.25,36.71 21.27,35.74 21.27,35.02 Q1.2 | 25.89,31.34 25.89,32.38 26.17,32.66 28.1,32.66 29.05,31.7 30.78,31.7 31.04,31.96 | v27,30.8 26.5,30.8 26.26,31.04 26.19,31.04 25.89,31.34 | 31.67,15.73 31.7,15.7 v34.1,15.7 34.1,14.3 U3.14 | 31.67,15.73 31.67,16.59 31.39,16.87 U1.18 29.73,18.7 29.49,18.7 29.2,18.99 29.2,19.14 29,19.3 v30.1,20.4 | C10.1 28.92,13.92 29,14 29.95,14 30.47,14.53 | 30.47,14.53 31.67,15.73 | R5.2 v49.6,15.7 | U1.6 v24.9,24.9 | U1.4 27.02,25.54 26.74,25.82 26.74,27.03 27.3,27.59 27.3,28.3 27.5,28.5 27.31,28.69 26.89,28.69 26.77,28.81 26.77,29.43 v26.4,29.8 | v29.5,25 29.5,24.91 29.1,24.61 29.1,24.19 29.32,23.97 29.32,21.92 v28.87,21.46 | U3.1 31.12,13.88 30.47,14.53 | R6.2 v44.6,10.2 | v50.2,13.3 49.95,13.3 R5.2 | 31.04,31.96 32.49,31.96 C15.2 | R4.2 R7.2 47.5,6 v51.1,9.6 | U4.P$8 25.33,12.72 25.9,13.3 | 25.9,13.3 25.9,13.95 U4.P$2 | U4.P$6 26.62,12.88 26.6,12.9 | 26.6,12.9 28.9,12.9 C10.1 | 25.9,13.3 26.6,12.9 | 29.66,8.76 30,9.1 v30.1,9.1 | v28.3,8.8 28.15,8.65 U2.9 | U2.5 U2.6 26.53,7.72 26.53,8.41 26.65,8.53 26.84,8.53 U2.9 | U2.9 U2.10 | J1.4 30.34,32.66 31.04,31.96
  Bottom 0.152: v27,30.8 26.4,30.2 v26.4,29.8 26.4,28.11 26.3,28.01 26.3,27.59 26.59,27.3 27.3,27.3 28.67,25.87 v29.5,25 | v49.6,15.7 v34.1,15.7 | v24.9,24.9 v28.87,21.46 v30.1,20.4 | v44.6,10.2 47.1,10.2 49.15,12.25 | 49.15,12.25 v50.2,13.3 | v51.1,9.6 51.1,10.3 49.15,12.25 | v30.1,9.1 28.6,9.1 v28.3,8.8

### Text on the board
tPlace: RXI | DTR | TXO | VCC | GND | GND | Siguino, Rev: 1.0 | VCC | GND | A1 | A2 | ATMEGA328P | A6 | PROANT ONBOARD 868 | A7 | D3 | D6 | LIS3DH | BME280 | SCK | MOSI | LIS3MDL | MISO | AH9246-W7 | SS | MAG SENSE | RST | SCL | SDA